# EasyEDA schematic VRAM SIMM MT42C8255DJ v1.0_Sch_EasyEDA.json
TITLE: VRAM SIMM MT42C8255DJ v1.0; REV: 1.0; Date: 2021-03-06; Sheet: 1/1; Drawn By: SuperSVGA; Company: SuperSVGA
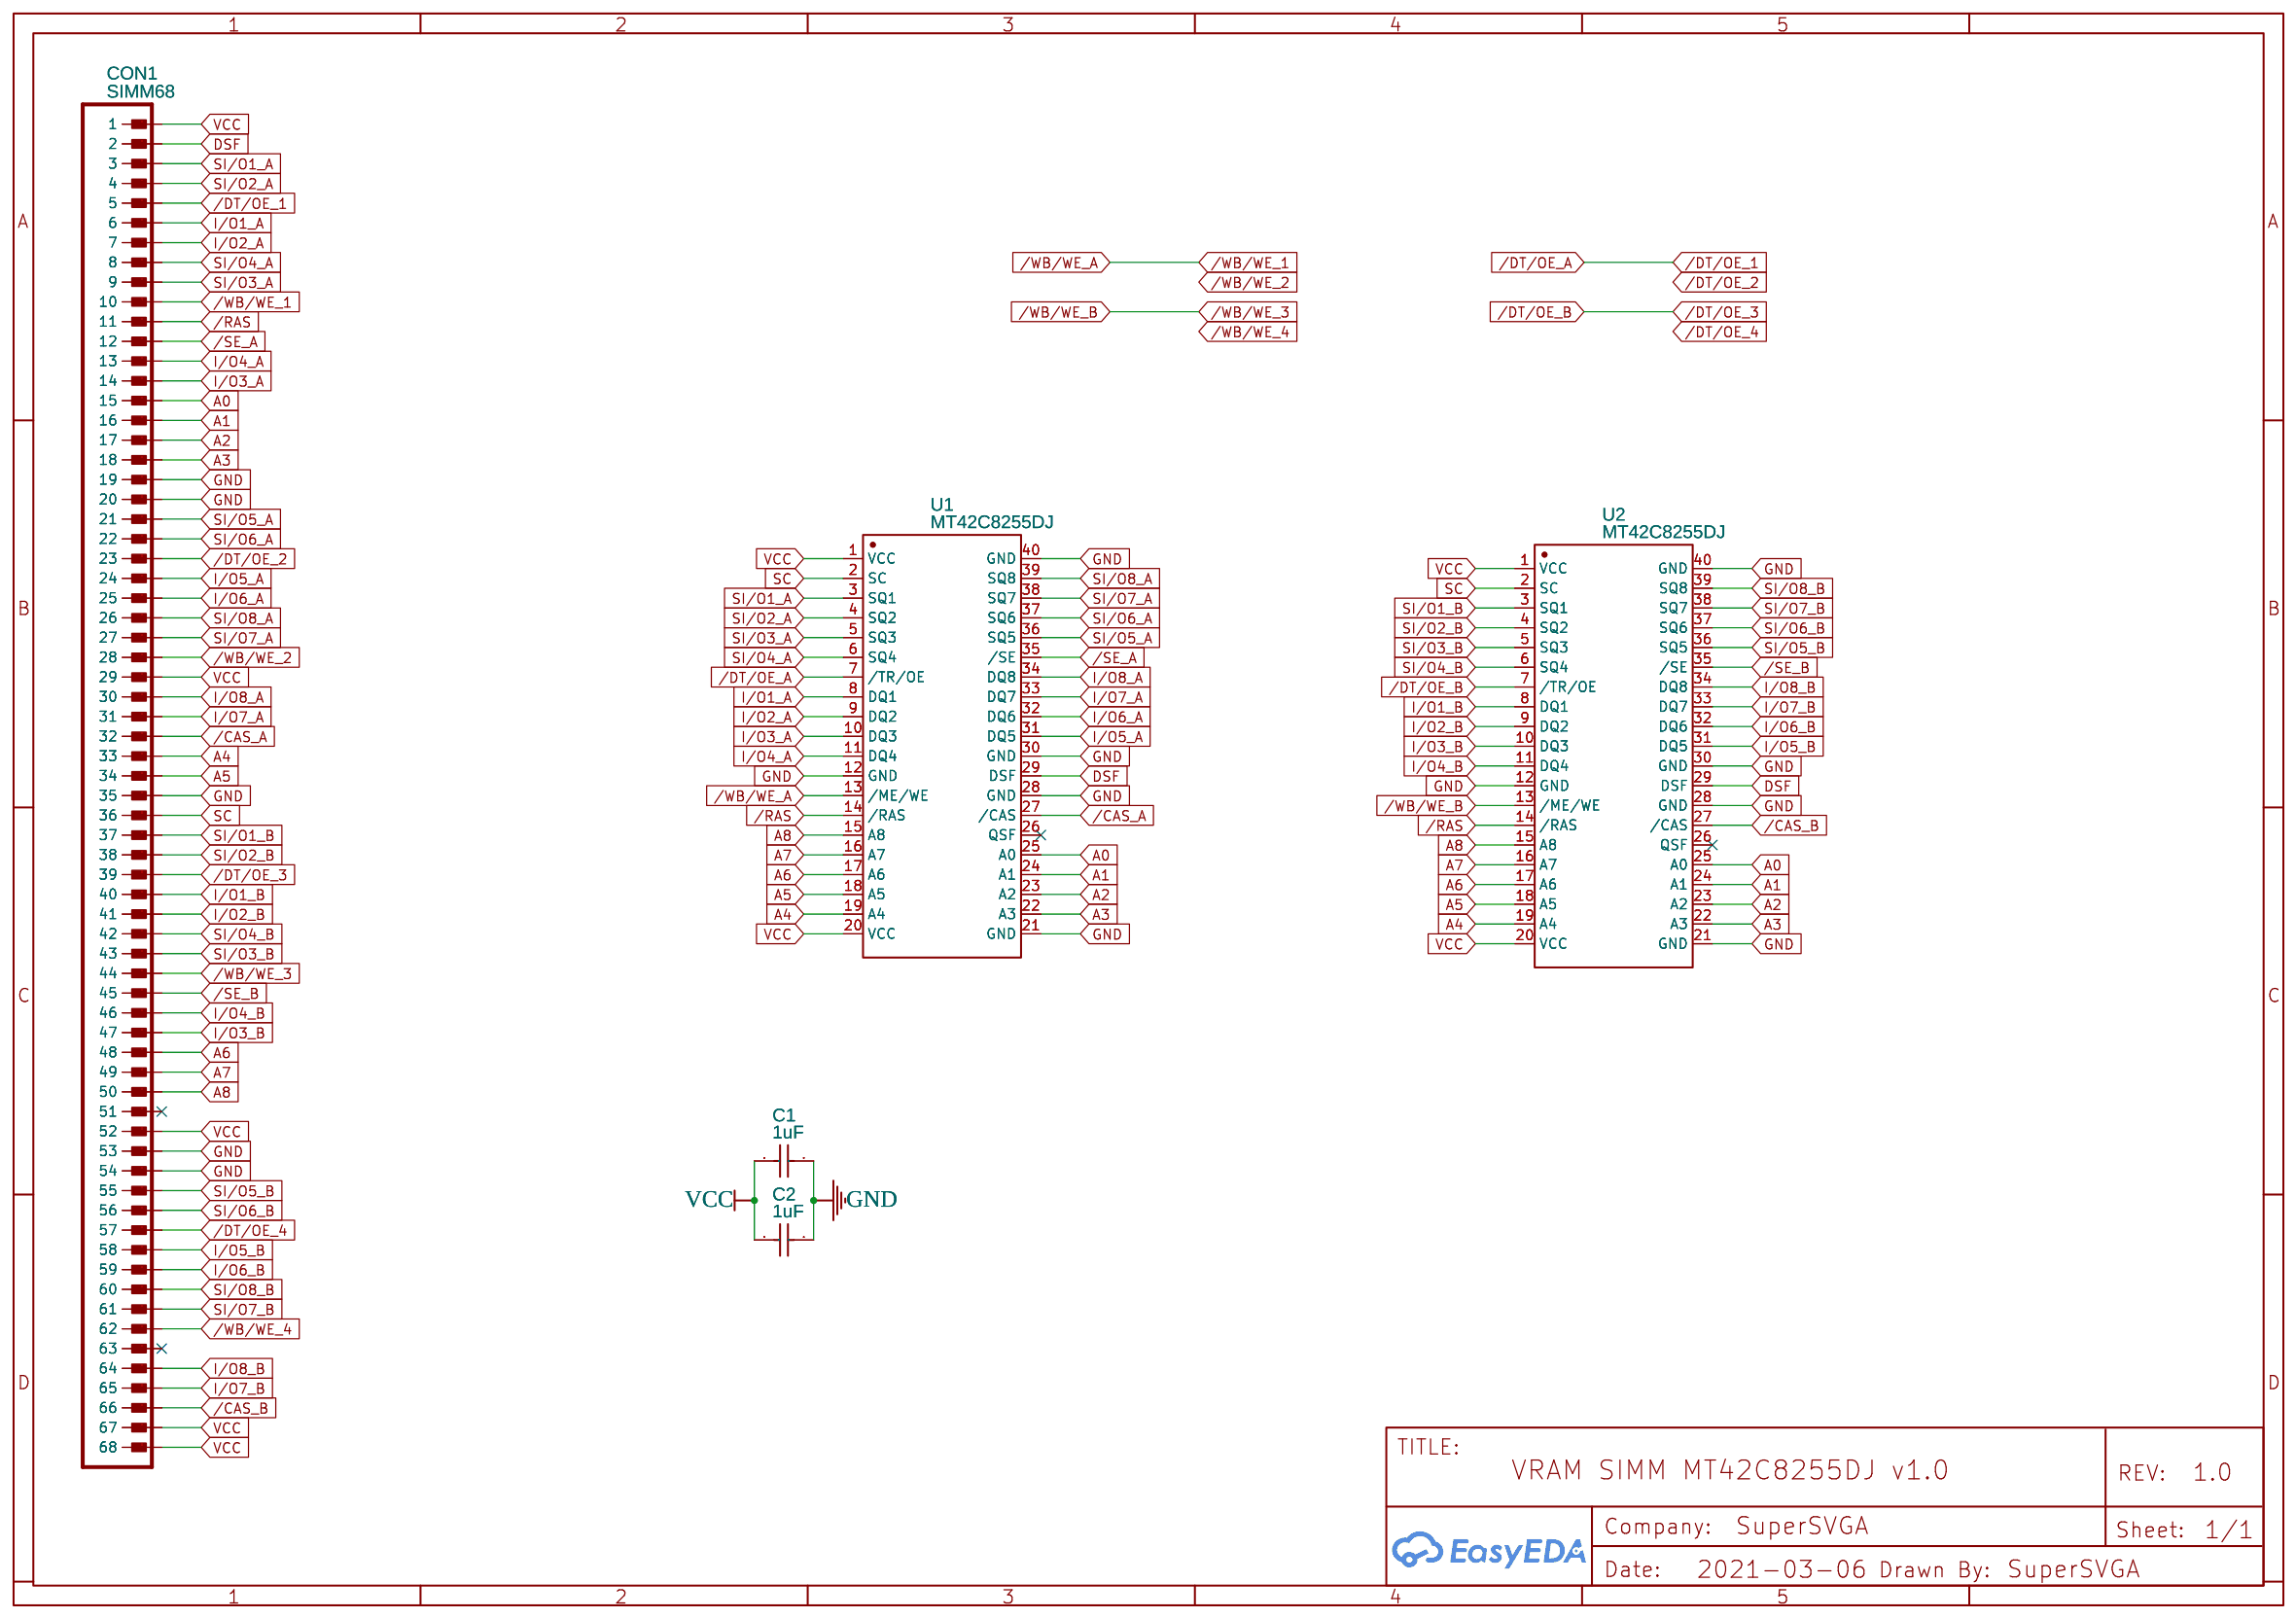
[diagram p0: schematic sheet]

## Parts
C1  1uF  [C0603]
C2  1uF  [C0603]
CON1  SIMM68  [SIMM68R]
U1  MT42C8255DJ  [SOJ40]
U2  MT42C8255DJ  [SOJ40]

## Library data of the parts
C1 C2 = CL10A105KP8NNNC: Supplier: LCSC; Manufacturer: SAMSUNG; Supplier Part: C26413; Assembly Type: smtWeld; Paste Type: expand
CON1 = SIMM68: AMP connector; Contributor: SuperSVGA
U1 U2 = MT42C8255DJ: Manufacturer: Micron; Contributor: SuperSVGA

## Nets
GND: C1.2 C2.2 CON1.19 CON1.20 CON1.35 CON1.53 CON1.54 U1.12(GND) U1.21(GND) U1.28(GND) U1.30(GND) U1.40(GND) U2.12(GND) U2.21(GND) U2.28(GND) U2.30(GND) U2.40(GND)
VCC: C1.1 C2.1 CON1.1 CON1.29 CON1.52 CON1.67 CON1.68 U1.1(VCC) U1.20(VCC) U2.1(VCC) U2.20(VCC)
/CAS_A: CON1.32 U1.27(/CAS)
/CAS_B: CON1.66 U2.27(/CAS)
/DT/OE_1: CON1.5 U1.7(/TR/OE)
/DT/OE_2: CON1.23
/DT/OE_3: CON1.39 U2.7(/TR/OE)
/DT/OE_4: CON1.57
/RAS: CON1.11 U1.14(/RAS) U2.14(/RAS)
/SE_A: CON1.12 U1.35(/SE)
/SE_B: CON1.45 U2.35(/SE)
/WB/WE_1: CON1.10 U1.13(/ME/WE)
/WB/WE_2: CON1.28
/WB/WE_3: CON1.44 U2.13(/ME/WE)
/WB/WE_4: CON1.62
A0: CON1.15 U1.25(A0) U2.25(A0)
A1: CON1.16 U1.24(A1) U2.24(A1)
A2: CON1.17 U1.23(A2) U2.23(A2)
A3: CON1.18 U1.22(A3) U2.22(A3)
A4: CON1.33 U1.19(A4) U2.19(A4)
A5: CON1.34 U1.18(A5) U2.18(A5)
A6: CON1.48 U1.17(A6) U2.17(A6)
A7: CON1.49 U1.16(A7) U2.16(A7)
A8: CON1.50 U1.15(A8) U2.15(A8)
DSF: CON1.2 U1.29(DSF) U2.29(DSF)
I/O1_A: CON1.6 U1.8(DQ1)
I/O1_B: CON1.40 U2.8(DQ1)
I/O2_A: CON1.7 U1.9(DQ2)
I/O2_B: CON1.41 U2.9(DQ2)
I/O3_A: CON1.14 U1.10(DQ3)
I/O3_B: CON1.47 U2.10(DQ3)
I/O4_A: CON1.13 U1.11(DQ4)
I/O4_B: CON1.46 U2.11(DQ4)
I/O5_A: CON1.24 U1.31(DQ5)
I/O5_B: CON1.58 U2.31(DQ5)
I/O6_A: CON1.25 U1.32(DQ6)
I/O6_B: CON1.59 U2.32(DQ6)
I/O7_A: CON1.31 U1.33(DQ7)
I/O7_B: CON1.65 U2.33(DQ7)
I/O8_A: CON1.30 U1.34(DQ8)
I/O8_B: CON1.64 U2.34(DQ8)
SC: CON1.36 U1.2(SC) U2.2(SC)
SI/O1_A: CON1.3 U1.3(SQ1)
SI/O1_B: CON1.37 U2.3(SQ1)
SI/O2_A: CON1.4 U1.4(SQ2)
SI/O2_B: CON1.38 U2.4(SQ2)
SI/O3_A: CON1.9 U1.5(SQ3)
SI/O3_B: CON1.43 U2.5(SQ3)
SI/O4_A: CON1.8 U1.6(SQ4)
SI/O4_B: CON1.42 U2.6(SQ4)
SI/O5_A: CON1.21 U1.36(SQ5)
SI/O5_B: CON1.55 U2.36(SQ5)
SI/O6_A: CON1.22 U1.37(SQ6)
SI/O6_B: CON1.56 U2.37(SQ6)
SI/O7_A: CON1.27 U1.38(SQ7)
SI/O7_B: CON1.61 U2.38(SQ7)
SI/O8_A: CON1.26 U1.39(SQ8)
SI/O8_B: CON1.60 U2.39(SQ8)

Not connected (* = marked no-connect by the designer): CON1 51* 63*; U1 26(QSF)*; U2 26(QSF)*
